# Altium schematic sheet [02] - BLOCK DIAGRAM.SchDoc
size A3; DocumentNumber: 2; SheetNumber: 2; SheetTotal: 5
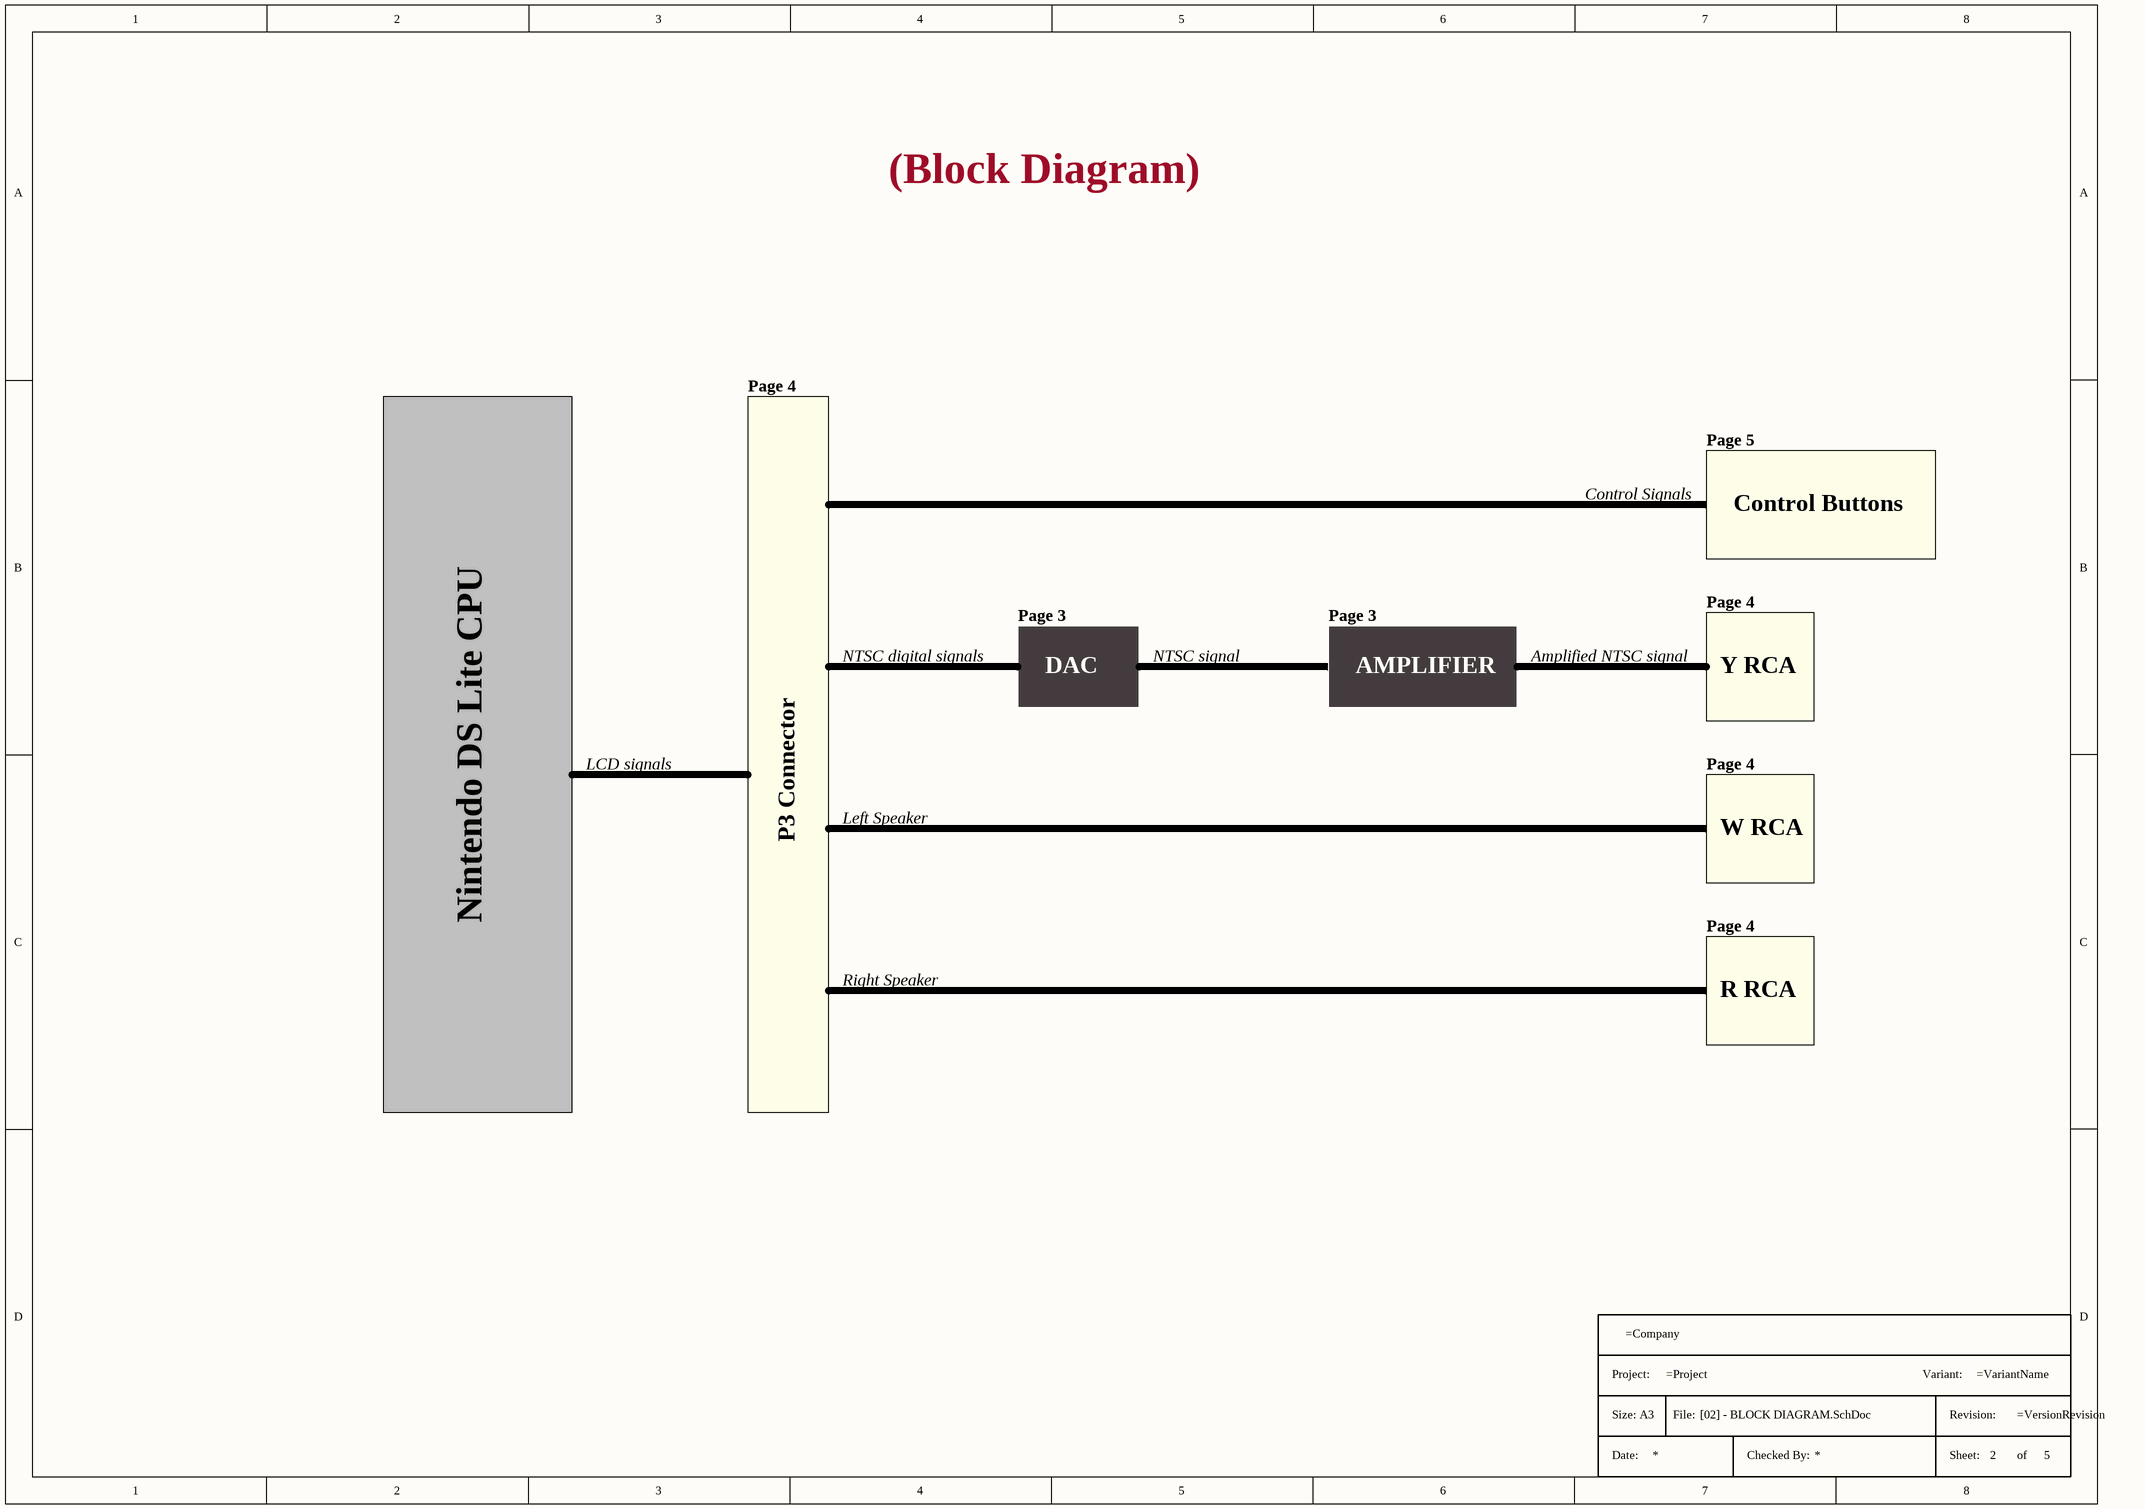
[diagram p0: [02] - BLOCK DIAGRAM.SchDoc]

## Parts
*  Title Block A3  (value not drawn)  (graphical)

## Notes on the sheet
- (Block Diagram)
- Page 4
- Page 5
- Control Signals
- Control Buttons
- Page 3
- NTSC digital signals
- DAC
- NTSC signal
- AMPLIFIER
- Amplified NTSC signal
- Y RCA
- LCD signals
- P3 Connector
- Left Speaker
- W RCA
- Nintendo DS Lite CPU
- Right Speaker
- R RCA
- CLOCKS (CPU & PCIE)
- (in symbol Title Block A3) Project:; Variant:; Size: A3; File:; Revision:; Date:; Checked By:; Sheet:; of